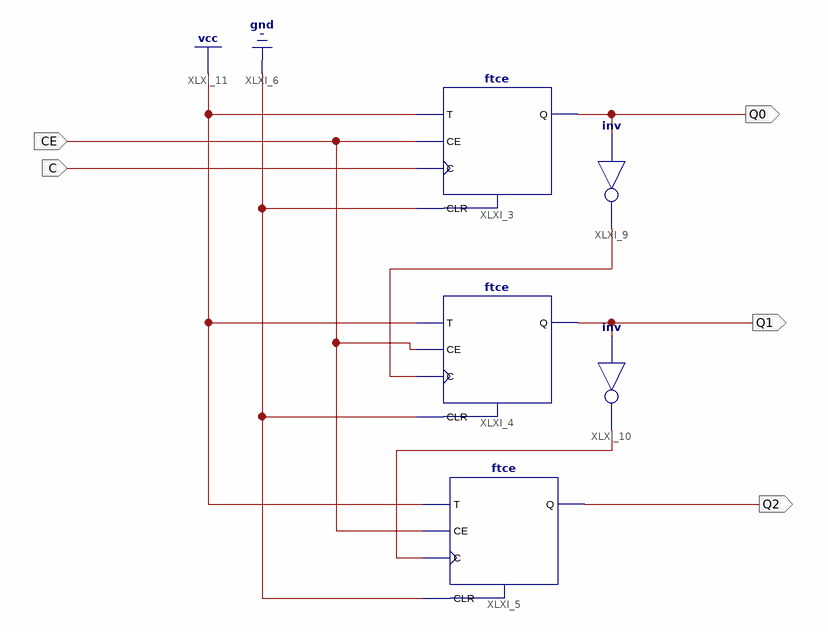
[diagram p0: schematic sheet 1]
// Xilinx ISE schematic counter_asyn.sch (spartan3adsp) as structural Verilog: 5 symbols, 5 ports
module counter_asyn (
  input  CE,
  input  C,
  output Q0,
  output Q1,
  output Q2
);

  ftce XLXI_3 (.C(C), .CE(CE), .CLR(1'b0), .T(1'b1), .Q(Q0));
  ftce XLXI_4 (.C(Q0), .CE(CE), .CLR(1'b0), .T(1'b1), .Q(Q1));
  ftce XLXI_5 (.C(Q1), .CE(CE), .CLR(1'b0), .T(1'b1), .Q(Q2));
  not XLXI_9 (Q0, Q0);
  not XLXI_10 (Q1, Q1);
endmodule
